# EAGLE design Serial_Keyboard_one (EAGLE 7.1.0)
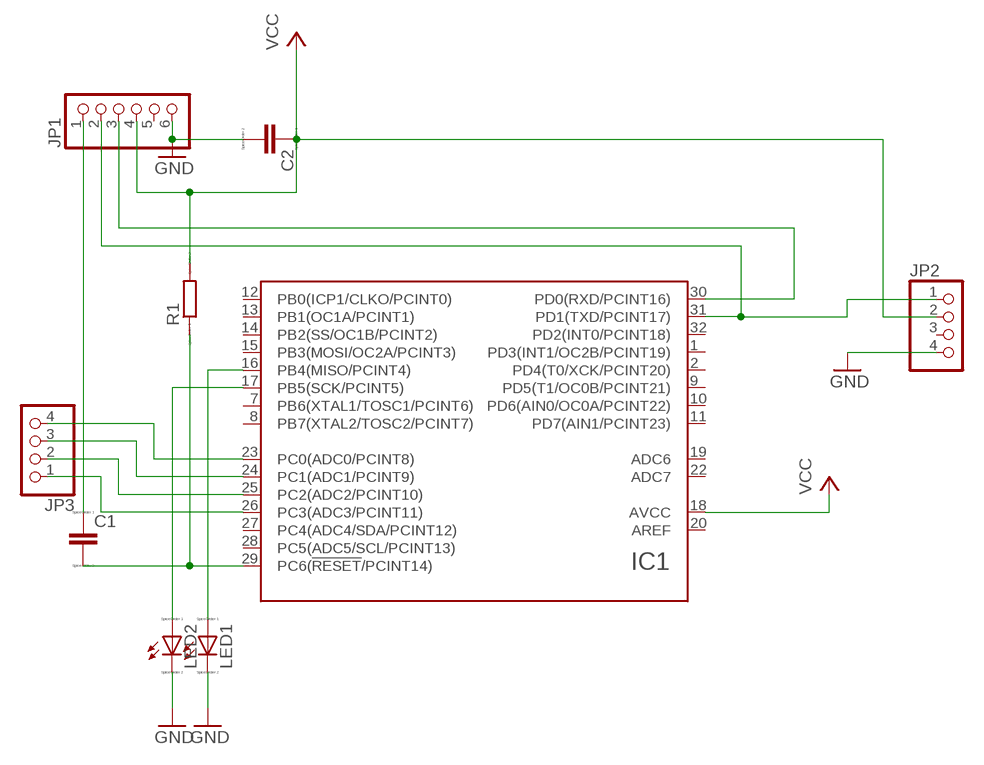
[diagram p0: schematic, sheet 1]

## Parts
C1  CC0603  [C0603]
C2  CC0603  [C0603]
IC1  ATMEGA48/88/168/328-AU  [TQFP32-08]
JP1  PINHD-1X6  [1X06]
JP2  PINHD-1X4  [1X04]
JP3  PINHD-1X4  [1X04]
LED1  LED_ELD260  [LED_LD260]
LED2  LED_ELD260  [LED_LD260]
R1  RR0603  [R0603]

## Nets
GND: C2.2 JP1.6 JP2.4 LED1.K(C) LED2.K(C)
N$1: C1.1 JP1.1
N$2: C1.2 IC1.29(PC6(!RESET!/PCINT14)) R1.1
N$3: IC1.31(PD1(TXD/PCINT17)) JP1.2 JP2.1
N$4: IC1.30(PD0(RXD/PCINT16)) JP1.3
N$7: IC1.23(PC0(ADC0/PCINT8)) JP3.4
N$8: IC1.24(PC1(ADC1/PCINT9)) JP3.3
N$9: IC1.25(PC2(ADC2/PCINT10)) JP3.2
N$10: IC1.26(PC3(ADC3/PCINT11)) JP3.1
N$11: IC1.17(PB5(SCK/PCINT5)) LED2.A
N$12: IC1.16(PB4(MISO/PCINT4)) LED1.A
VCC: C2.1 IC1.18(AVCC) JP1.4 JP2.2 R1.2
Unconnected: IC1.1(PD3(INT1/OC2B/PCINT19)) IC1.2(PD4(T0/XCK/PCINT20)) IC1.7(PB6(XTAL1/TOSC1/PCINT6)) IC1.8(PB7(XTAL2/TOSC2/PCINT7)) IC1.9(PD5(T1/OC0B/PCINT21)) IC1.10(PD6(AIN0/OC0A/PCINT22)) IC1.11(PD7(AIN1/PCINT23)) IC1.12(PB0(ICP1/CLKO/PCINT0)) IC1.13(PB1(OC1A/PCINT1)) IC1.14(PB2(SS/OC1B/PCINT2)) IC1.15(PB3(MOSI/OC2A/PCINT3)) IC1.19(ADC6) IC1.20(AREF) IC1.22(ADC7) IC1.27(PC4(ADC4/SDA/PCINT12)) IC1.28(PC5(ADC5/SCL/PCINT13)) IC1.32(PD2(INT0/PCINT18)) JP1.5 JP2.3

## Power pins joined to a net without a drawn wire
GND: IC1.3(GND) IC1.5(GND) IC1.21(GND)
UCC: IC1.4(UCC) IC1.6(UCC)

## Library data of the parts
C1 C2 = eagle-ltspice:C: CAPACITOR, European symbol; SPICEMODEL: NONE; SPICEPREFIX: C
IC1 = atmel_tiny24-44-84tiny48-88mega48-88-168-328:ATMEGA48/88/168/328
JP1 = pinhead:PINHD-1X6: PIN HEADER
JP2 JP3 = pinhead:PINHD-1X4: PIN HEADER
LED1 LED2 = eagle-ltspice:LED_E: LED Source: http://www.osram.convergy.de Source: www.luxeon.com Source: www.kingbright.com; SPICEMODEL: NONE; SPICEPREFIX: D; SPICETYPE: diode
R1 = eagle-ltspice:R: RESISTOR, European symbol; SPICEMODEL: NONE; SPICEPREFIX: R

## Board
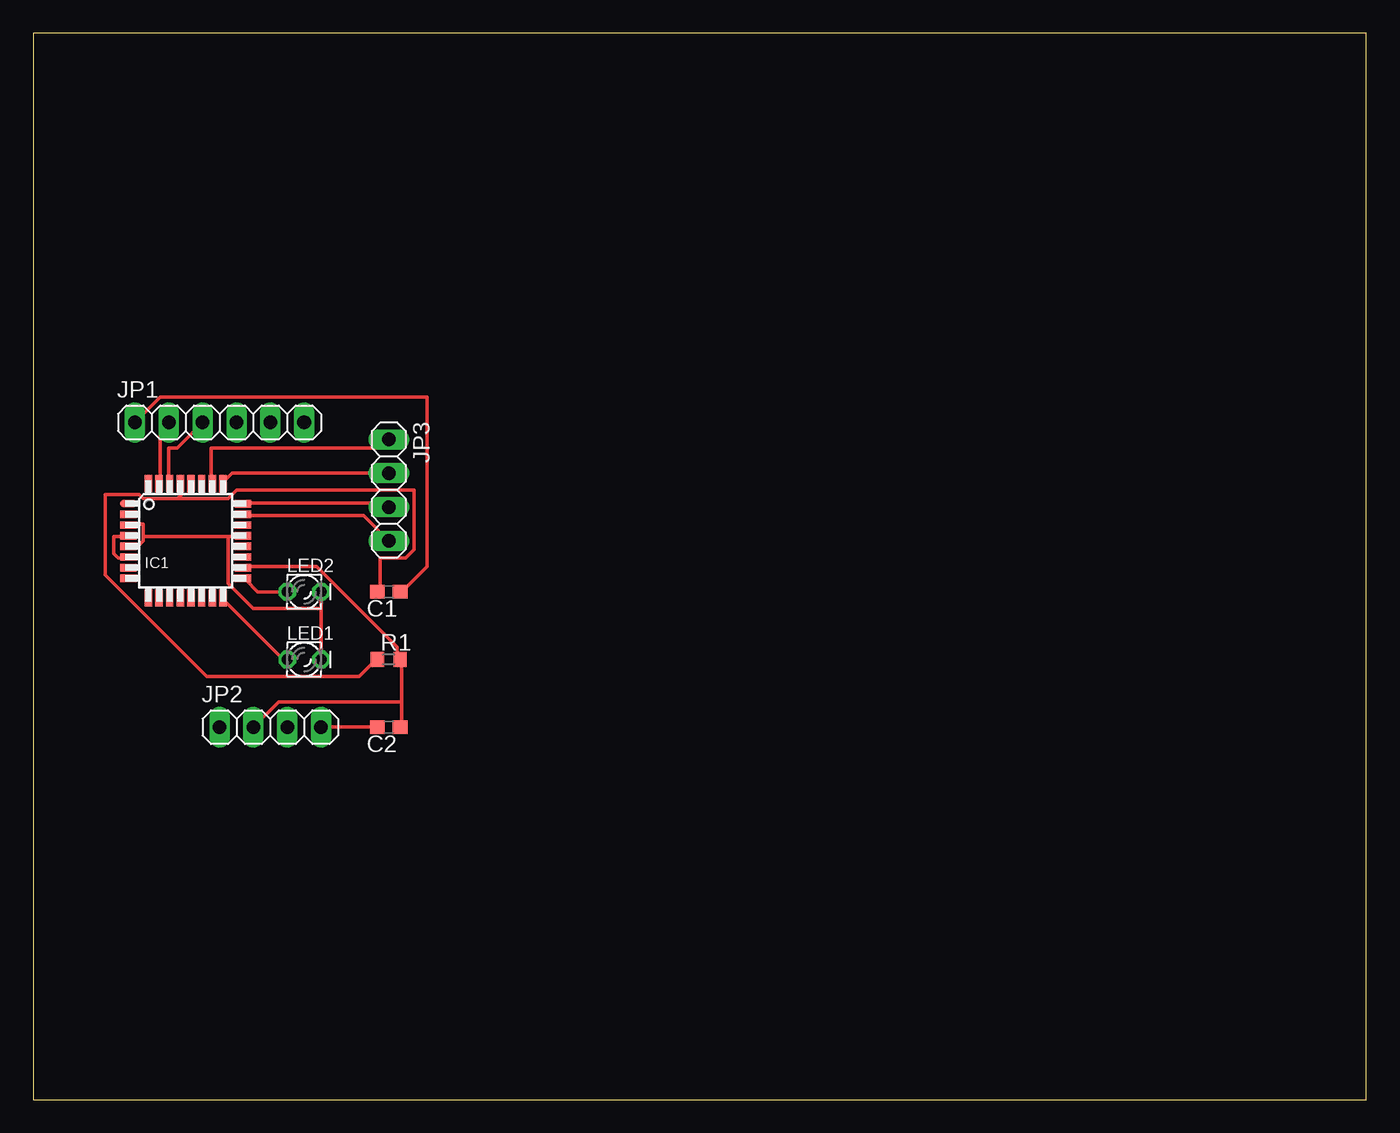
[diagram p1: board, top side]
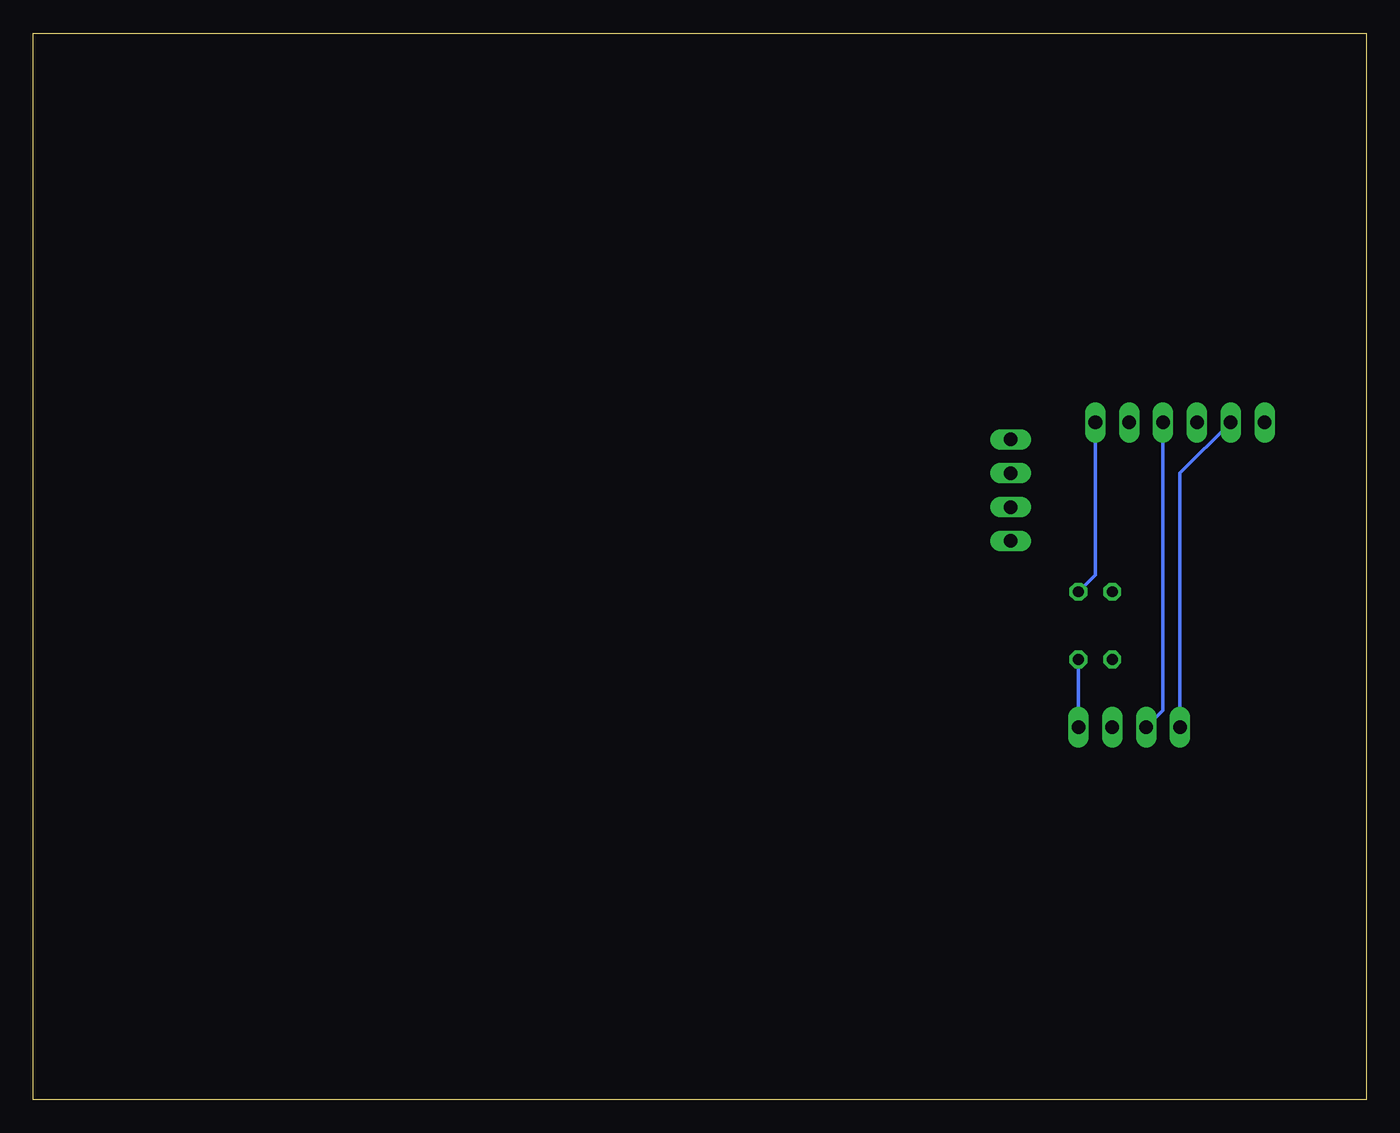
[diagram p2: board, bottom side, seen from below]

Size 100 x 80 mm. Coordinates in mm from the lower left corner, seen from the top.
Outline: 0,0 100,0 100,80 0,80 0,0
Copper layers (1*16): Top 0.035mm / dielectric 1.5mm / Bottom 0.035mm
Design rules "default": minimum track width 10mil, minimum drill 24mil, track to track 8mil, track to pad 8mil, pad to pad 8mil, via to via 8mil, smd to smd 8mil, copper to edge 40mil, drill to drill 8mil, minimum pad ring 10mil, minimum via ring 8mil, stop-mask expansion 4mil, vias tented up to drill 0mil, thermal gap 10mil

### Footprints (pad centres in the part's own frame; a part is rotated, then mirrored left to right if it is on the bottom)
C0603 = smd 1.1 x 1: 1 -0.85,0; 2 0.85,0
TQFP32-08 = smd 1.27 x 0.55: 1 -4.293,2.8; 2 -4.293,2; 3 -4.293,1.2; 4 -4.293,0.4; 5 -4.293,-0.4; 6 -4.293,-1.2; 7 -4.293,-2; 8 -4.293,-2.8; 17 4.293,-2.8; 18 4.293,-2; 19 4.293,-1.2; 20 4.293,-0.4; 21 4.293,0.4; 22 4.293,1.2; 23 4.293,2; 24 4.293,2.8 | smd 0.55 x 1.27: 9 -2.8,-4.293; 10 -2,-4.293; 11 -1.2,-4.293; 12 -0.4,-4.293; 13 0.4,-4.293; 14 1.2,-4.293; 15 2,-4.293; 16 2.8,-4.293; 25 2.8,4.293; 26 2,4.293; 27 1.2,4.293; 28 0.4,4.293; 29 -0.4,4.293; 30 -1.2,4.293; 31 -2,4.293; 32 -2.8,4.293
1X06 = drill 1.016 long: 1 -6.35,0; 2 -3.81,0; 3 -1.27,0; 4 1.27,0; 5 3.81,0; 6 6.35,0
1X04 = drill 1.016 long: 1 -3.81,0; 2 -1.27,0; 3 1.27,0; 4 3.81,0
LED_LD260 = drill 0.813 octagon: A -1.27,0; K 1.27,0
R0603 = smd 1 x 1.1: 1 -0.85,0; 2 0.85,0

### Placement (x,y rotation side)
C1  26.67,38.1 180 top
C2  26.67,27.94 180 top
IC1  11.43,41.91 0 top
JP1  13.97,50.8 0 top
JP2  17.78,27.94 0 top
JP3  26.67,45.72 270 top
LED1  20.32,33.02 0 top
LED2  20.32,38.1 0 top
R1  26.67,33.02 0 top

### Tracks (layer width: path | path; a pad name or v marks a point on that pad's centre or on a via)
GND
  Top 0.254: 8.26,42.23 8.26,43.18 7.3,43.18 IC1.3 | 8.26,42.23 8.26,41.91 7.94,41.59 7.3,41.59 IC1.5 | 8.26,42.23 14.61,42.23 | 14.61,42.23 15.56,42.23 IC1.21 | JP2.4 C2.2 | LED2.K 21.59,36.83 | 21.59,36.83 LED1.K | 14.61,42.23 14.61,38.73 16.51,36.83 21.59,36.83
  Bottom 0.254: JP1.6 20.32,39.37 LED2.K | LED1.K JP2.4
N$1
  Top 0.254: JP1.1 9.53,52.7 29.53,52.7 29.53,40.01 27.62,38.1 C1.1
N$2
  Top 0.254: 10.79,45.09 8.26,45.09 7.94,45.4 5.4,45.4 5.4,39.37 13.02,31.75 24.45,31.75 25.72,33.02 R1.1 | 10.79,45.09 11.11,45.4 11.11,46.04 IC1.29 | 10.79,45.09 14.61,45.09 15.24,45.72 28.57,45.72 28.57,41.27 27.94,40.64 26.04,40.64 26.04,38.1 C1.2
N$3
  Top 0.254: JP1.2 9.53,50.8 9.53,46.35 IC1.31
  Bottom 0.254: JP2.1 13.97,46.99 JP1.2
N$4
  Top 0.254: JP1.3 10.79,48.9 10.16,48.9 10.16,46.35 IC1.30
N$7
  Top 0.254: JP3.4 24.77,43.81 15.88,43.81 IC1.23
N$8
  Top 0.254: JP3.3 26.35,44.77 15.88,44.77 IC1.24
N$9
  Top 0.254: JP3.2 14.92,46.99 14.29,46.35 IC1.25
N$10
  Top 0.254: JP3.1 26.04,48.9 13.34,48.9 13.34,46.35 IC1.26
N$11
  Top 0.254: LED2.A 16.83,38.1 15.88,39.05 IC1.17
N$12
  Top 0.254: LED1.A 18.73,33.02 14.29,37.47 IC1.16
UCC
  Top 0.254: IC1.6 6.99,40.64 6.35,40.64 6.03,40.96 6.03,42.23 6.99,42.23 IC1.4
VCC
  Top 0.254: 27.62,29.84 27.62,33.02 R1.2 27.3,33.02 27.3,33.97 21.27,40.01 15.88,40.01 IC1.18 | 27.62,29.84 27.62,27.94 C2.1 | 27.62,29.84 18.41,29.84 JP2.2
  Bottom 0.254: JP1.4 15.24,29.21 JP2.2